# EAGLE schematic thunder_rev_a (EAGLE 6.5.0)

## Sheet 1 of 2
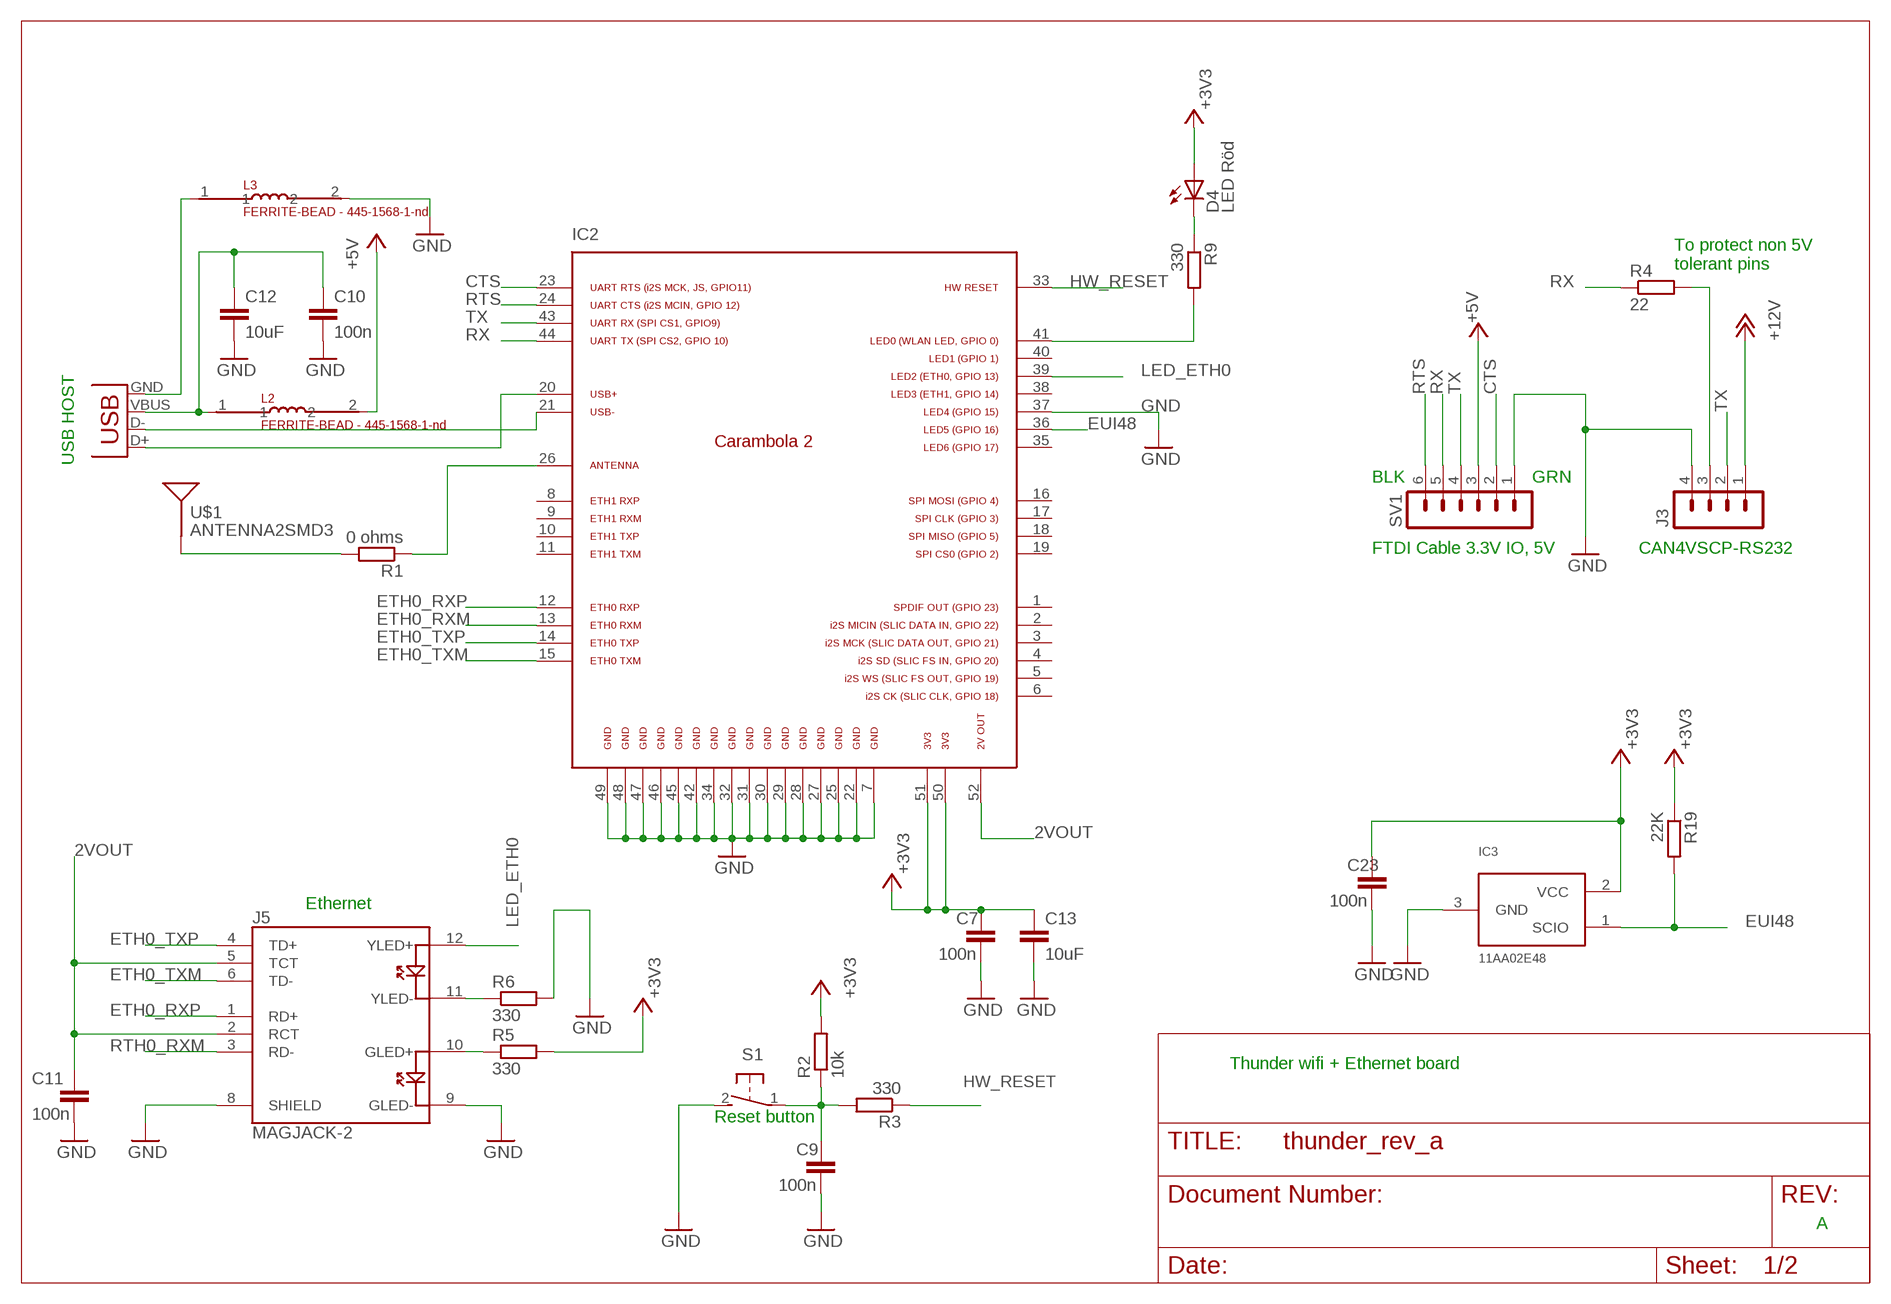
[diagram p0: schematic, sheet 1]

### Parts
C7  100n  C-EUC0805  [C0805]
C9  100n  C-EUC0805  [C0805]
C10  100n  C-EUC0805  [C0805]
C11  100n  C-EUC0805  [C0805]
C12  10uF  C-EUC0805  [C0805]
C13  10uF  C-EUC0805  [C0805]
C23  100n  C-EUC0805  [C0805]
D4  LED Röd  LED_2012  [C2012]
IC2  CARAMBOLA2  [CARAMBOLA2]
IC3  11AA02E48  [SOT23]
J3  MA04-1  [MA04-1]
J5  MAGJACK-2  [MAGJACK-19938]
JP1  USB-A-SMD  [USB-A-S-NOSILK-FEMALE]
L2  FERRITE-BEAD - 445-1568-1-nd  FERRITE-BEAD  [0805]
L3  FERRITE-BEAD - 445-1568-1-nd  FERRITE-BEAD  [0805]
R1  0 ohms  R-EU_M0805  [M0805]
R2  10k  R-EU_M0805  [M0805]
R3  330  R-EU_M0805  [M0805]
R4  22  R-EU_M0805  [M0805]
R5  330  R-EU_M0805  [M0805]
R6  330  R-EU_M0805  [M0805]
R9  330  R-EU_M0805  [M0805]
R19  22K  R-EU_M0805  [M0805]
S1  31-XX  [B3F-31XX]
SV1  MA06-1  [MA06-1]
U$1  ANTENNA2SMD3  [ANTENNA-CHIP4]

### Nets
2VOUT: C11.1 IC2.52 J5.2(RCT) J5.5(TCT)
22: IC2.7 IC2.22 IC2.25 IC2.27 IC2.28 IC2.29 IC2.30 IC2.31 IC2.32 IC2.34 IC2.42 IC2.45 IC2.46 IC2.47 IC2.48 IC2.49 ; supply symbol labelled GND
50: C7.1 C13.1 IC2.50 IC2.51 ; supply symbol labelled +3V3
+3V3: C23.1 D4.1(A) IC3.2(VCC) R2.2 R5.2 R19.1 ; also sheet 2
+5V: L2.2 SV1.3 ; also sheet 2
+12V: J3.1 ; also sheet 2
CTS: IC2.23 SV1.2
ETH0_RXM: IC2.13
ETH0_RXP: IC2.12 J5.1(RD+)
ETH0_TXM: IC2.15 J5.6(TD-)
ETH0_TXP: IC2.14 J5.4(TD+)
EUI48: IC2.36 IC3.1(SCIO) R19.2
GND: C7.2 C9.2 C10.2 C11.2 C12.2 C13.2 C23.2 IC2.37 IC3.3(GND) J3.4 J5.8(SHIELD) J5.9(GLED-) L3.2 R6.2 S1.2(S) SV1.1 ; also sheet 2
HW_RESET: IC2.33 R3.1
LED_ETH0: IC2.39 J5.12(YLED+)
N$2: C9.1 R2.1 R3.2 S1.1(P)
N$4: IC2.41 R9.2
N$5: J5.10(GLED+) R5.1
N$6: IC2.21 JP1.D-
N$7: J5.11(YLED-) R6.1
N$9: R1.2 U$1.SIG(SIGNAL)
N$10: IC2.26 R1.1
N$11: J3.3 R4.2
N$14: D4.2(C) R9.1
N$16: IC2.20 JP1.D+
N$17: C10.1 C12.1 JP1.VBUS L2.1
N$18: JP1.GND L3.1
RTH0_RXM: J5.3(RD-)
RTS: IC2.24 SV1.6
RX: IC2.44 R4.1 SV1.5
TX: IC2.43 J3.2 SV1.4
Unconnected: IC2.1 IC2.2 IC2.3 IC2.4 IC2.5 IC2.6 IC2.8 IC2.9 IC2.10 IC2.11 IC2.16 IC2.17 IC2.18 IC2.19 IC2.35 IC2.38 IC2.40

### Notes on the sheet
- To protect non 5V
  tolerant pins
- USB HOST
- BLK | GRN
- FTDI Cable 3.3V IO, 5V | CAN4VSCP-RS232
- Ethernet
- Thunder wifi + Ethernet board
- Reset button
- A

## Sheet 2 of 2
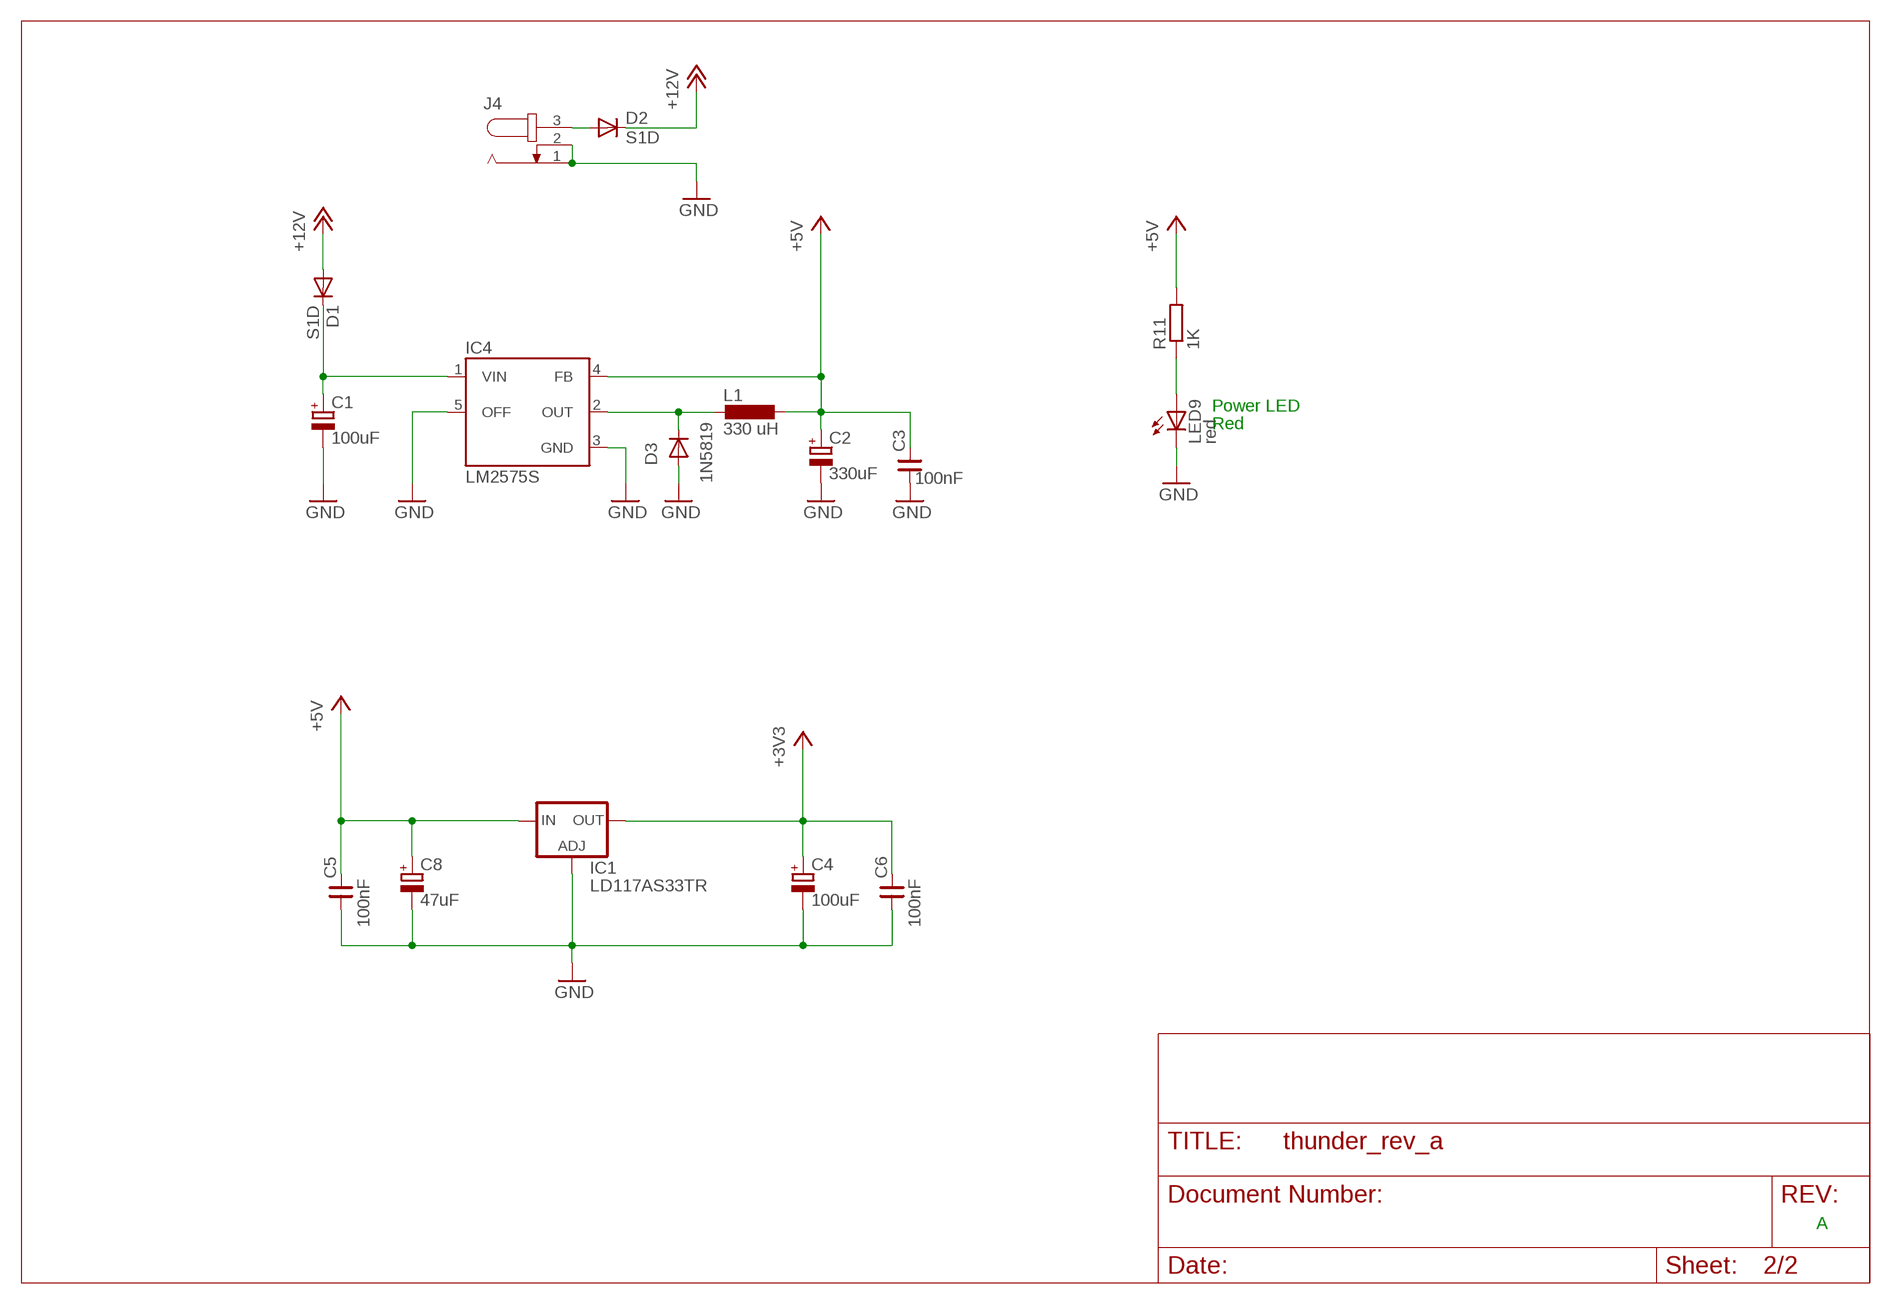
[diagram p1: schematic, sheet 2]

### Parts
C1  100uF  CPOL-EUD  [PANASONIC_D]
C2  330uF  CPOL-EUD  [PANASONIC_D]
C3  100nF  CNP-0805  [0805]
C4  100uF  CPOL-EUD  [PANASONIC_D]
C5  100nF  CNP-0805  [0805]
C6  100nF  CNP-0805  [0805]
C8  47uF  CPOL-EUD  [PANASONIC_D]
D1  S1D  DIODE-SOD123  [SOD123]
D2  S1D  DIODE-SMB  [SMB]
D3  1N5819  DIODE-SOD123  [SOD123]
IC1  LD117AS33TR  [SOT223]
IC4  LM2575S  [TO263-5]
J4  JACK-PLUG0  [SPC4077]
L1  330 uH  DO3316P  [DO3316P]
LED9  red  LEDCHIP-LED0805  [CHIP-LED0805]
R11  1K  R-EU_R0805  [R0805]

### Nets
+3V3: C4.+ C6.2 IC1.4(OUT) ; also sheet 1
+5V: C2.+ C3.2 C5.2 C8.+ IC1.3(IN) IC4.4(FB) L1.2 R11.2 ; also sheet 1
+12V: D1.A D2.C ; also sheet 1
GND: C1.- C2.- C3.1 C4.- C5.1 C6.1 C8.- D3.A IC1.1(ADJ) IC4.3(GND) IC4.5(OFF) J4.1 J4.2 LED9.C ; also sheet 1
N$1: D3.C IC4.2(OUT) L1.1
N$3: C1.+ D1.C IC4.1(VIN)
N$8: D2.A J4.3
N$20: LED9.A R11.1

### Notes on the sheet
- Power LED
- Red
- A

## Library data of the parts
C1 C2 C4 C8 = rcl:CPOL-EU: POLARIZED CAPACITOR, European symbol
C3 C5 C6 = cap-master:CNP-: NON-POLARIZED CAP
C7 C9-C13 C23 = rcl:C-EU: CAPACITOR, European symbol
D1-D3 = diode:DIODE-: DIODE
D4 = snow:LED_2012
IC1 = v-reg:LD117A?*: Low drop fixed and adjustable positive voltage regulators 1 A Source: http://www.st.com/stonline/products/literature/ds/7194/ld1117axx.pdf
IC2 = carambola2:CARAMBOLA2
IC3 = snow:11AA02E48
IC4 = v-reg-3:LM2575: National Semiconductor <http://www.national.com> 1.0A "Simple Switcher"(c) 52kHz, Vout 1.23-37V (HV: 57V), Vin 40V (HV: 60V), 50µA standby current
J3 = con-lstb:MA04-1: PIN HEADER; OC_FARNELL: unknown; OC_NEWARK: unknown
J4 = con-jack-special:JACK-PLUG: DC POWER JACK Power Jack, DC, Right Angle, Through Hole, Rated 5A at 16VDC, PC Terminals Distributor: Farnell (www.Farnell.de) Drawing: 84N1161.pdf / 84N1162.pdf Manufacturer: SPC Technology (www.spctechnology.com) Type: SPC4077 / SPC 4078; OC_FARNELL: unknown; OC_NEWARK: unknown
J5 = SparkFun-Connectors:MAGJACK-2: RJ-45 with LEDs
JP1 = SparkFun-Connectors:USB: USB Connectors USB-B-PTH is fully proven SKU : PRT-00139/CONN-08278 USB-miniB is fully proven SKU : PRT-00587 USB-A-PCB is untested. USB-A-H is throughly reviewed, but untested. Spark Fun Electronics SKU : PRT-00437 USB-B-SMT is throughly reviewed, but untested. Needs silkscreen touching up. USB-A-S has not been used/tested USB-MB-H has not been used/tested USB-MICROB has been used. CONN-09505; PROD_ID: CONN-09520
L1 = inductor-coilcraft:DO3316P: COILCRAFT
L2 L3 = snow:FERRITE-BEAD
LED9 = led:LED: LED OSRAM: - CHIPLED LG R971, LG N971, LY N971, LG Q971, LY Q971, LO R971, LY R971 LH N974, LH R974 LS Q976, LO Q976, LY Q976 LO Q996 - Hyper CHIPLED LW Q18S LB Q993, LB Q99A, LB R99A - SideLED LS A670, LO A670, LY A670, LG A670, LP A670 LB A673, LV A673, LT A673, LW A673 LH A674 LY A675 LS A676, LA A676, LO A676, LY A676, LW A676 LS A679, LY A679, LG A679 - Hyper Micro SIDELED® LS Y876, LA Y876, LO Y876, LY Y876 LT Y87S - SmartLED LW L88C, LW L88S LB L89C, LB L89S, LG L890 LS L89K, LO L89K, LY L89K LS L896, LA L896, LO L896, LY L896 - TOPLED LS T670, LO T670, LY T670, LG T670, LP T670 LSG T670, LSP T670, LSY T670, LOP T670, LYG T670 LG T671, LOG T671, LSG T671 LB T673, LV T673, LT T673, LW T673 LH T674 LS T676, LA T676, LO T676, LY T676, LB T676, LH T676, LSB T676, LW T676 LB T67C, LV T67C, LT T67C, LS T67K, LO T67K, LY T67K, LW E67C LS E67B, LA E67B, LO E67B, LY E67B, LB E67C, LV E67C, LT E67C LW T67C LS T679, LY T679, LG T679 LS T770, LO T770, LY T770, LG T770, LP T770 LB T773, LV T773, LT T773, LW T773 LH T774 LS E675, LA E675, LY E675, LS T675 LS T776, LA T776, LO T776, LY T776, LB T776 LHGB T686 LT T68C, LB T68C - Hyper Mini TOPLED® LB M676 - Mini TOPLED Santana® LG M470 LS M47K, LO M47K, LY M47K Source: http://www.osram.convergy.de LUXEON: - LUMILED® LXK2-PW12-R00, LXK2-PW12-S00, LXK2-PW14-U00, LXK2-PW14-V00 LXK2-PM12-R00, LXK2-PM12-S00, LXK2-PM14-U00 LXK2-PE12-Q00, LXK2-PE12-R00, LXK2-PE12-S00, LXK2-PE14-T00, LXK2-PE14-U00 LXK2-PB12-K00, LXK2-PB12-L00, LXK2-PB12-M00, LXK2-PB14-N00, LXK2-PB14-P00, LXK2-PB14-Q00 LXK2-PR12-L00, LXK2-PR12-M00, LXK2-PR14-Q00, LXK2-PR14-R00 LXK2-PD12-Q00, LXK2-PD12-R00, LXK2-PD12-S00 LXK2-PH12-R00, LXK2-PH12-S00 LXK2-PL12-P00, LXK2-PL12-Q00, LXK2-PL12-R00 Source: www.luxeon.com KINGBRIGHT: KA-3528ASYC Source: www.kingbright.com
R1-R6 R9 R11 R19 = rcl:R-EU_: RESISTOR, European symbol
S1 = switch-omron:31-XX: OMRON SWITCH; MPN: B3F-3100; OC_FARNELL: 959704; OC_NEWARK: 36M3582
SV1 = con-lstb:MA06-1: PIN HEADER; OC_FARNELL: unknown; OC_NEWARK: unknown
U$1 = SparkFun-RF:ANTENNA2: Chip antenna Single endded antenna. Common with smaller chip antennas. CHIP4 package is the GPS Chip Antenna SKU: GPS-08418. CHIP5 package is 2.4GHz chip antenna SKU: WRL-00144.